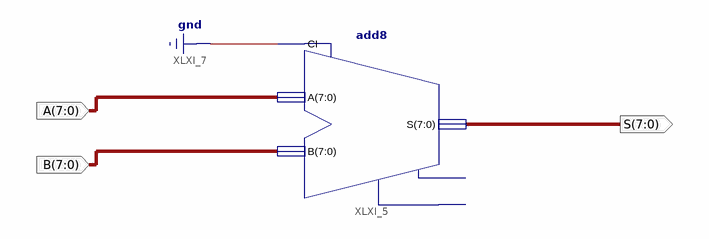
[diagram p0: schematic sheet 1]
// Xilinx ISE schematic Add.sch (spartan6) as structural Verilog: 1 symbols, 3 ports
module Add (
  input  [7:0] A,
  input  [7:0] B,
  output [7:0] S
);

  add8 XLXI_5 (.A(A), .B(B), .CI(1'b0), .S(S));  // open: CO, OFL
endmodule
